# EasyEDA schematic SCH_Bachelor-thesis_2025-02-08.json
TITLE: Sheet_1; REV: 1.0; Date: 2024-12-06; Sheet: 1/1; Drawn By: no.mit.tm; Company: Your Company
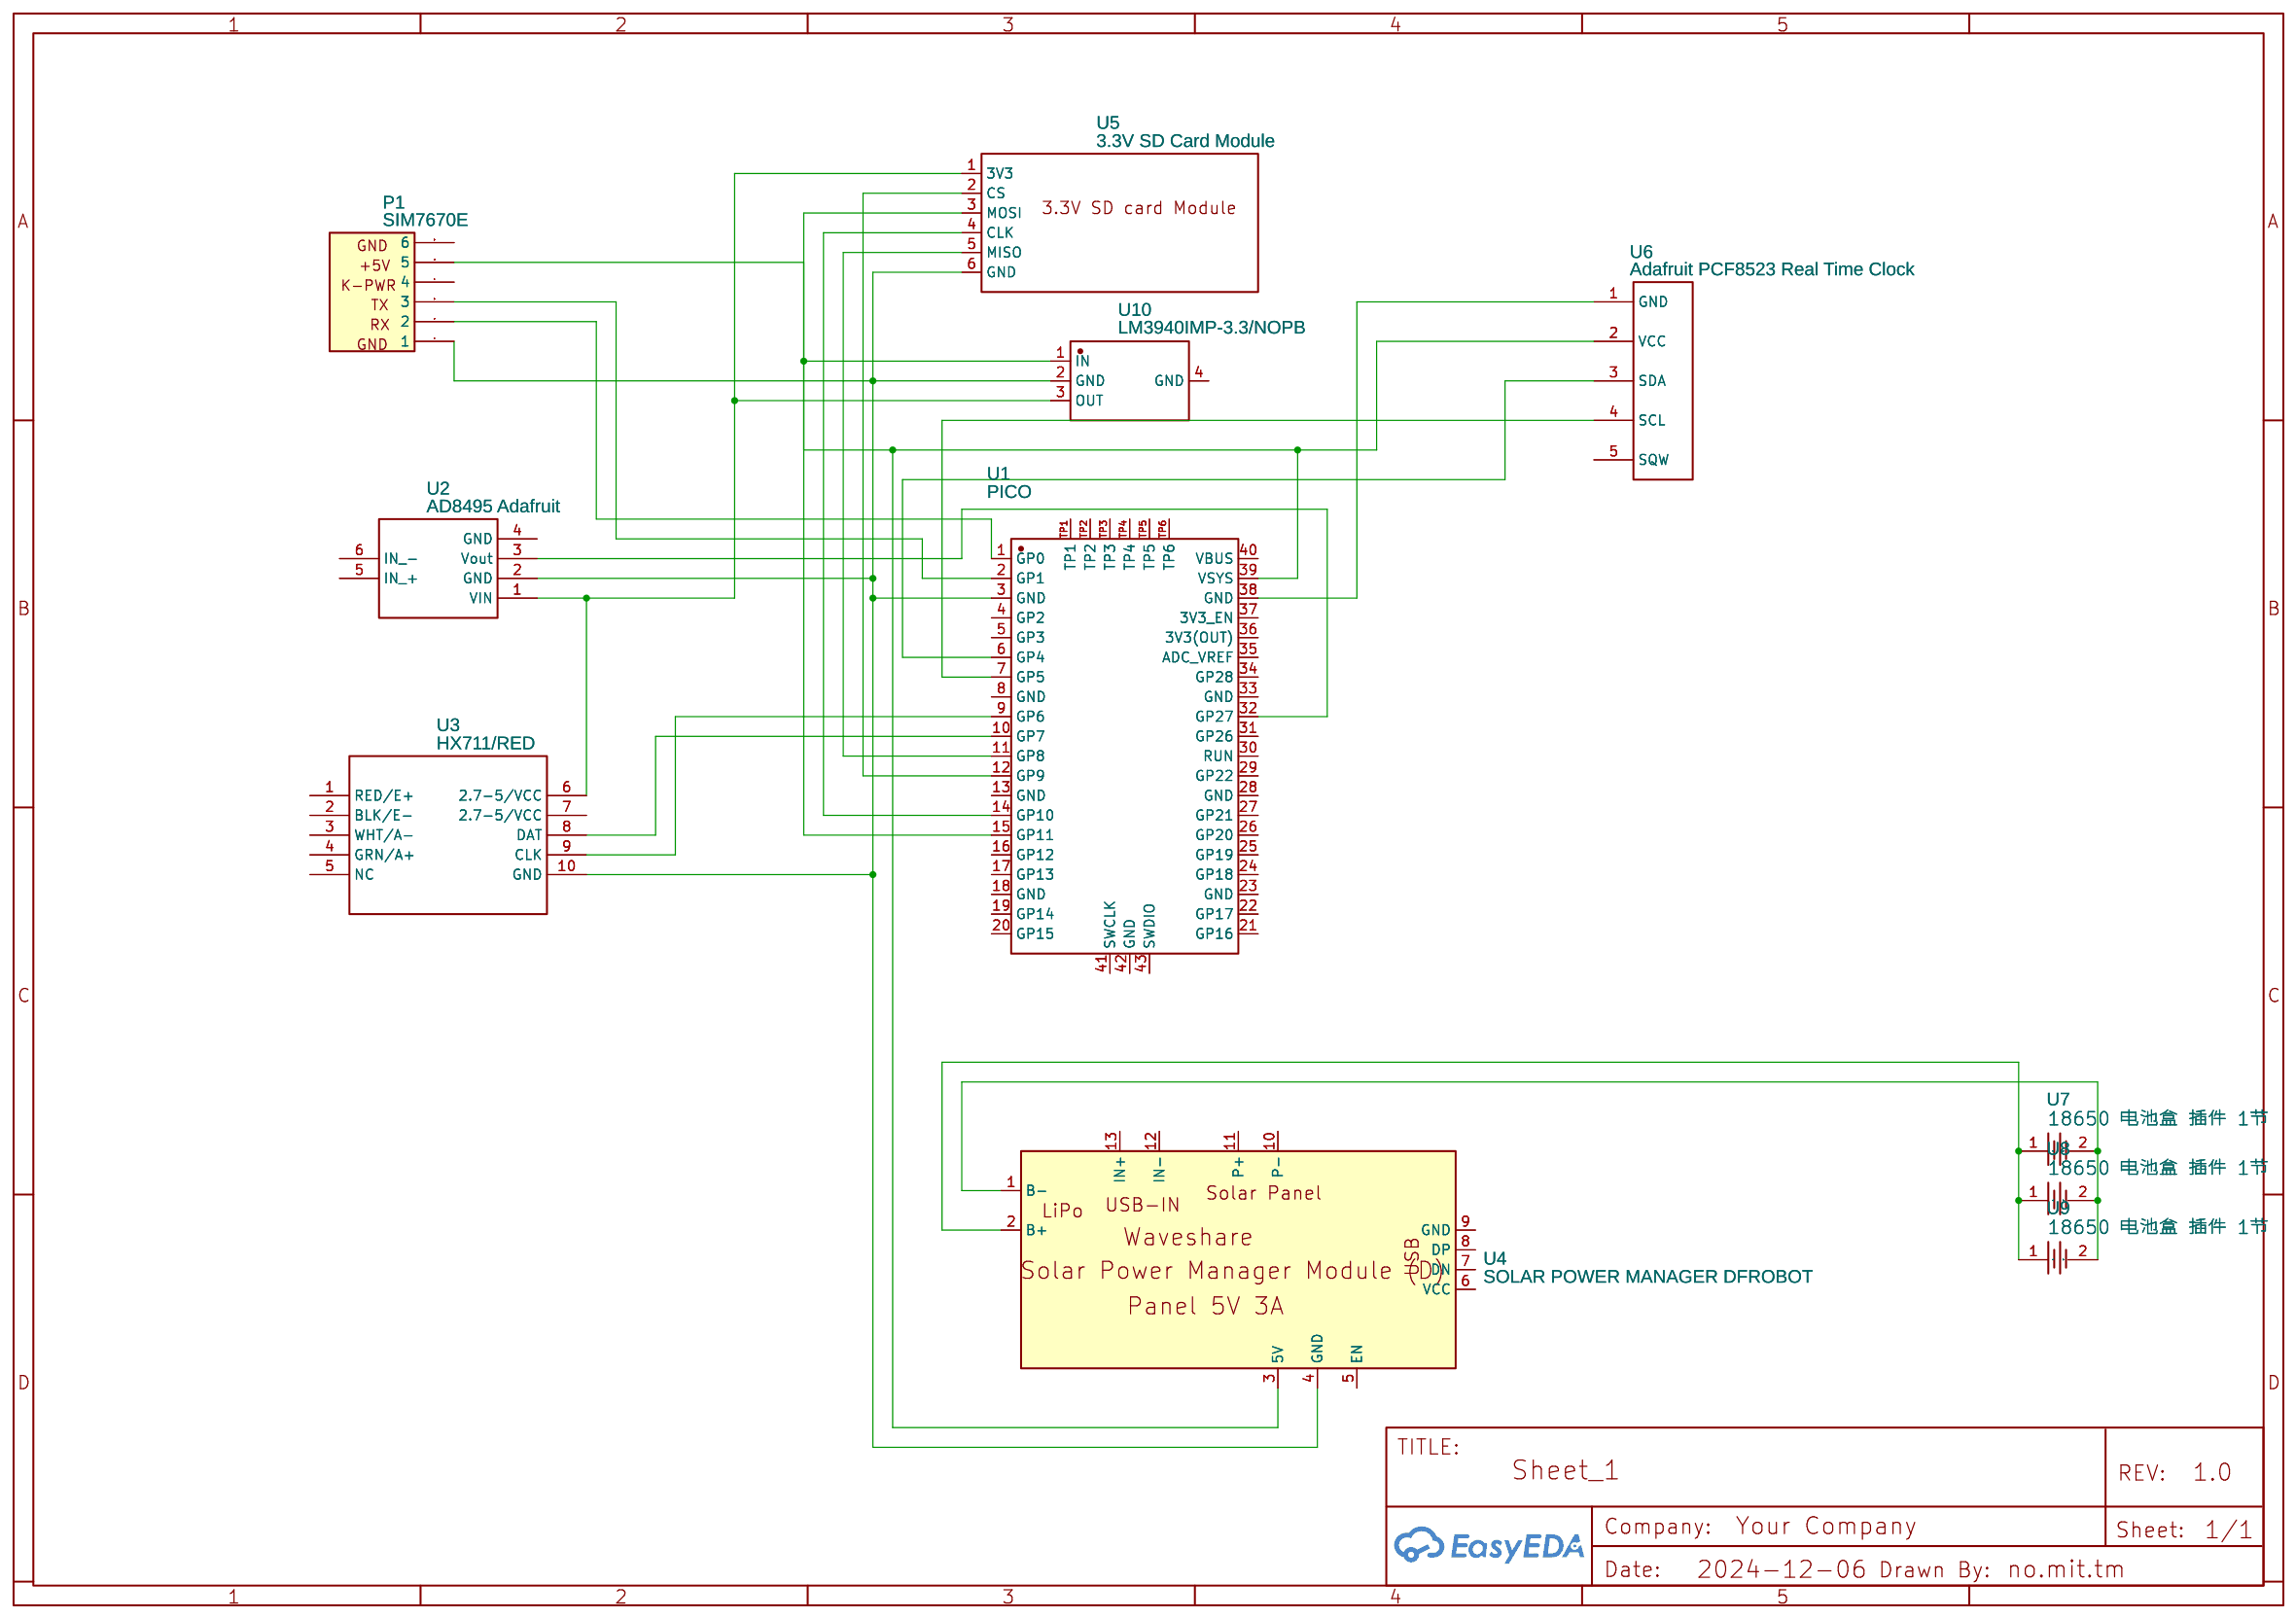
[diagram p0: schematic sheet]

## Parts
P1  SIM7670E  [SIM7670E]
U1  PICO  [COMM-SMD_L51.0-W21.0-P2.54_SC0916]
U2  AD8495 Adafruit  [AD8495 ADAFRUIT]
U3  HX711/RED  [HX711 LOAD CELL AMPLIFIER HX711 BREAKOUT]
U4  SOLAR POWER MANAGER DFROBOT  [SOLAR POWER MANAGER CN3065]
U5  3.3V SD Card Module
U6  Adafruit PCF8523 Real Time Clock  [ADAFRUIT PCF8523 REAL TIME CLOCK]
U7  18650 电池盒 插件 1节  [BAT-TH_18650-C9900004923]
U8  18650 电池盒 插件 1节  [BAT-TH_18650-C9900004923]
U9  18650 电池盒 插件 1节  [BAT-TH_18650-C9900004923]
U10  LM3940IMP-3.3/NOPB  [SOT-223_L6.5-W3.5-P2.30-LS7.0-BR]

## Library data of the parts
P1 = SIM7670E: Manufacturer: LCSC; Manufacturer Part: Header-Male-2.54_1x6; Contributor: mrilic66
U1 = PICO: Supplier: LCSC; Supplier Part: C7203002; Manufacturer: Raspberry Pi(树莓派); JLCPCB Part Class: Extended Part; Contributor: lcsc
U2 = AD8495 Adafruit: Manufacturer: Adafruit; Manufacturer Part: 1778; Supplier: Digi-Key; Supplier Part: 1528-1407-ND; link: https://www.digikey.com/en/products/detail/adafruit-industries-llc/1778/5638304; Contributor: ralph.v.montfort
U3 = HX711/RED: Contributor: lwmd92
U4 = SOLAR POWER MANAGER DFROBOT: Manufacturer: Sunflower; Manufacturer Part: Sunflower; Supplier: Sunflower; Supplier Part: DFR0559; Contributor: ManarAlkammessy1
U5 = 3.3V SD Card Module: Supplier: Robu.in; Contributor: sumeda91
U6 = Adafruit PCF8523 Real Time Clock: Contributor: Israrengineering
U7-U9 = 18650 电池盒 插件 1节: Contributor: LCSC; Supplier: LCSC; Supplier Part: C9900004923; Manufacturer: null; JLCPCB Part Class: Extended Part
U10 = LM3940IMP-3.3/NOPB: Contributor: LCSC; Supplier: LCSC; Supplier Part: C140319; Manufacturer: TI(德州仪器); JLCPCB Part Class: Extended Part

## Nets
Net-(P1-1): P1.1 U1.3(GND) U2.2(GND) U3.10(GND) U4.4(GND) U5.6(GND) U10.2(GND)
Net-(P1-2): P1.2 U1.1(GP0)
Net-(P1-3): P1.3 U1.2(GP1)
Net-(P1-5): P1.5 U1.15(GP11) U1.39(VSYS) U4.3(5V) U5.3(MOSI) U6.2(VCC) U10.1(IN)
Net-(U1-6): U1.6(GP4) U6.3(SDA)
Net-(U1-7): U1.7(GP5) U6.4(SCL)
Net-(U1-9): U1.9(GP6) U3.9(CLK)
Net-(U1-10): U1.10(GP7) U3.8(DAT)
Net-(U1-11): U1.11(GP8) U5.5(MISO)
Net-(U1-12): U1.12(GP9) U5.2(CS)
Net-(U1-14): U1.14(GP10) U5.4(CLK)
Net-(U1-32): U1.32(GP27) U2.3(Vout)
Net-(U1-38): U1.38(GND) U6.1(GND)
Net-(U2-1): U2.1(VIN) U3.6(2.7-5/VCC) U5.1(3V3) U10.3(OUT)
Net-(U4-1): U4.1(B-) U7.2 U8.2 U9.2
Net-(U4-2): U4.2(B+) U7.1 U8.1 U9.1

Not connected (* = marked no-connect by the designer): P1 4 6; U1 4(GP2) 5(GP3) 8(GND) 13(GND) 16(GP12) 17(GP13) 18(GND) 19(GP14) 20(GP15) 21(GP16) 22(GP17) 23(GND) 24(GP18) 25(GP19) 26(GP20) 27(GP21) 28(GND) 29(GP22) 30(RUN) 31(GP26) 33(GND) 34(GP28) 35(ADC_VREF) 36(3V3(OUT)) 37(3V3_EN) 40(VBUS) 41(SWCLK) 42(GND) 43(SWDIO) TP1 TP2 TP3 TP4 TP5 TP6; U2 4(GND) 5(IN +) 6(IN -); U3 1(RED/E+) 2(BLK/E-) 3(WHT/A-) 4(GRN/A+) 5(NC) 7(2.7-5/VCC); U4 5(EN) 6(VCC) 7(DN) 8(DP) 9(GND) 10(P-) 11(P+) 12(IN-) 13(IN+); U6 5(SQW); U10 4(GND)
